# EAGLE schematic mr_radar_platypus (EAGLE 5.11)
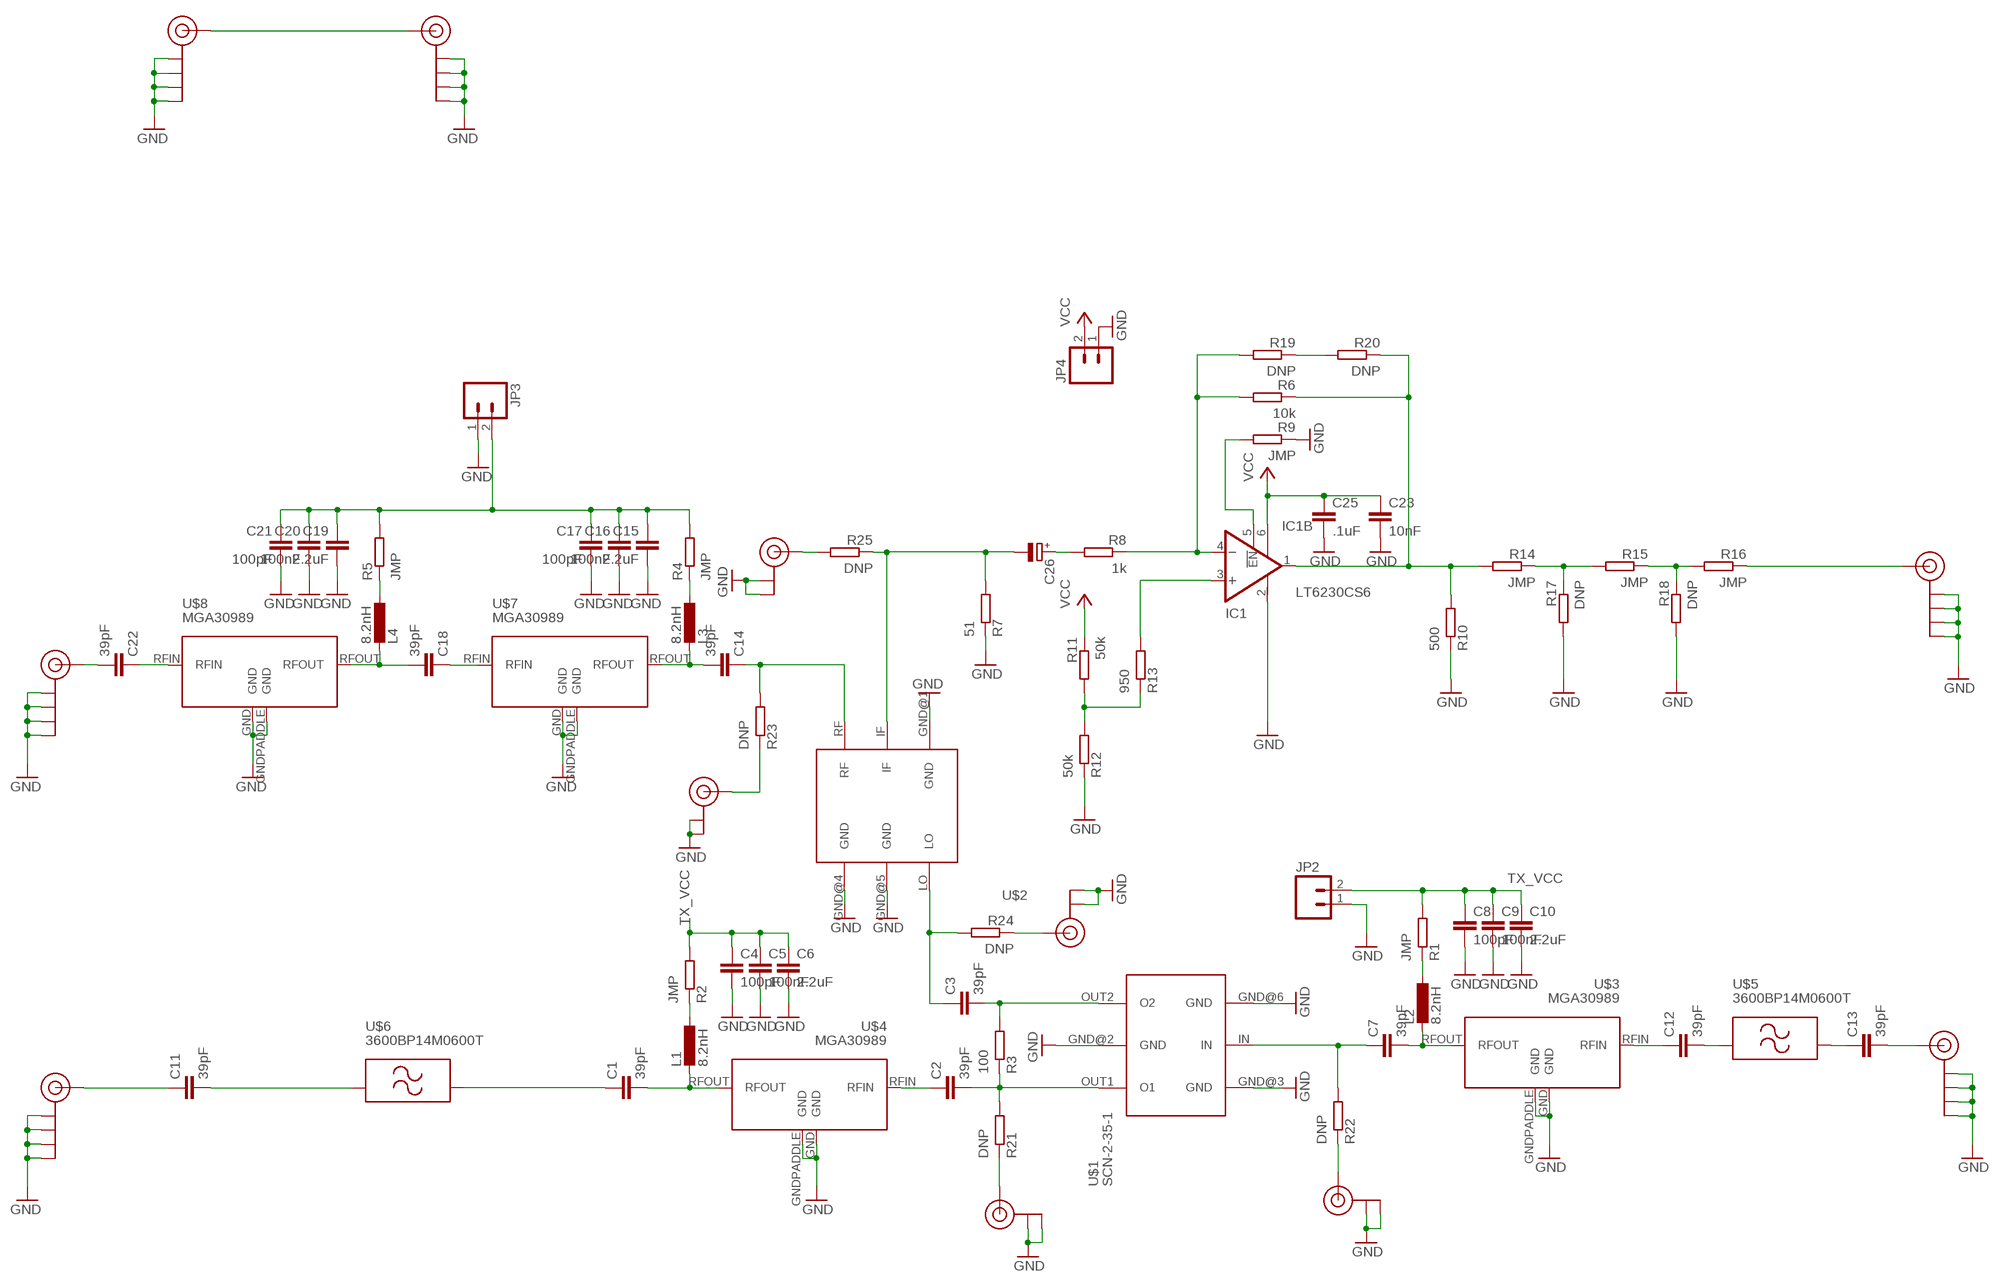
[diagram p0: schematic, sheet 1]

## Parts
C1  39pF  CAPACITOR-0402  [0402-CAP]
C2  39pF  CAPACITOR-0402  [0402-CAP]
C3  39pF  CAPACITOR-0402  [0402-CAP]
C4  100pF  CAPACITOR-0603  [0603-CAP]
C5  100nF  CAPACITOR-0603  [0603-CAP]
C6  2.2uF  CAPACITOR-0603  [0603-CAP]
C7  39pF  CAPACITOR-0402  [0402-CAP]
C8  100pF  CAPACITOR-0603  [0603-CAP]
C9  100nF  CAPACITOR-0603  [0603-CAP]
C10  2.2uF  CAPACITOR-0603  [0603-CAP]
C11  39pF  CAPACITOR-0402  [0402-CAP]
C12  39pF  CAPACITOR-0402  [0402-CAP]
C13  39pF  CAPACITOR-0402  [0402-CAP]
C14  39pF  CAPACITOR-0402  [0402-CAP]
C15  2.2uF  CAPACITOR-0402  [0402-CAP]
C16  100nF  CAPACITOR-0402  [0402-CAP]
C17  100pF  CAPACITOR-0402  [0402-CAP]
C18  39pF  CAPACITOR-0402  [0402-CAP]
C19  2.2uF  CAPACITOR-0402  [0402-CAP]
C20  100nF  CAPACITOR-0402  [0402-CAP]
C21  100pF  CAPACITOR-0402  [0402-CAP]
C22  39pF  CAPACITOR-0402  [0402-CAP]
C23  10nF  CAPACITOR-0603  [0603-CAP]
C25  .1uF  CAPACITOR-0603  [0603-CAP]
C26  CAPACITOR-POLD  [7343/D]
IC1  LT6230CS6  [TSOT23-6]
J$1  SMA_EDGE  [SMA-EDGE]
J$2  SMA_EDGE  [SMA-EDGE]
J$3  SMA_EDGE  [SMA-EDGE]
J$4  SMA_EDGE  [SMA-EDGE]
J$5  SMA_EDGE  [SMA-EDGE]
J$6  SMA_EDGE  [SMA-EDGE]
JP2  M02LOCK_LONGPADS  [1X02_LOCK_LONGPADS]
JP3  M02LOCK_LONGPADS  [1X02_LOCK_LONGPADS]
JP4  M02LOCK_LONGPADS  [1X02_LOCK_LONGPADS]
L1  8.2nH  INDUCTOR-0603  [0603-IND]
L2  8.2nH  INDUCTOR-0603  [0603-IND]
L3  8.2nH  INDUCTOR-0603  [0603-IND]
L4  8.2nH  INDUCTOR-0603  [0603-IND]
R1  JMP  RESISTOR-0603  [0603-RES]
R2  JMP  RESISTOR-0603  [0603-RES]
R3  100  RESISTOR-0603  [0603-RES]
R4  JMP  RESISTOR-0603  [0603-RES]
R5  JMP  RESISTOR-0603  [0603-RES]
R6  10k  RESISTOR-0603  [0603-RES]
R7  51  RESISTOR-0603  [0603-RES]
R8  1k  RESISTOR-0603  [0603-RES]
R9  JMP  RESISTOR-0603  [0603-RES]
R10  500  RESISTOR-0603  [0603-RES]
R11  50k  RESISTOR-0603  [0603-RES]
R12  50k  RESISTOR-0603  [0603-RES]
R13  950  RESISTOR-0603  [0603-RES]
R14  JMP  RESISTOR-0603  [0603-RES]
R15  JMP  RESISTOR-0603  [0603-RES]
R16  JMP  RESISTOR-0603  [0603-RES]
R17  DNP  RESISTOR-0603  [0603-RES]
R18  DNP  RESISTOR-0603  [0603-RES]
R19  DNP  RESISTOR-0603  [0603-RES]
R20  DNP  RESISTOR-0603  [0603-RES]
R21  DNP  RESISTOR-1206  [1206-RES]
R22  DNP  RESISTOR-1206  [1206-RES]
R23  DNP  RESISTOR-1206  [1206-RES]
R24  DNP  RESISTOR-1206  [1206-RES]
R25  DNP  RESISTOR-1206  [1206-RES]
U$1  SCN-2-35-1  [SCN-2-35-1]
U$2  ADE-30W+  [CD542]
U$3  MGA30989  [SOT89]
U$4  MGA30989  [SOT89]
U$5  3600BP14M0600T  [3600BP14M0600T]
U$6  3600BP14M0600T  [3600BP14M0600T]
U$7  MGA30989  [SOT89]
U$8  MGA30989  [SOT89]
U$9  U.FL  [U.FL]
U$10  U.FL  [U.FL]
U$11  U.FL  [U.FL]
U$12  U.FL  [U.FL]
U$13  U.FL  [U.FL]

## Nets
GND: C4.P$2 C5.P$2 C6.P$2 C8.P$2 C9.P$2 C10.P$2 C15.P$2 C16.P$2 C17.P$2 C19.P$2 C20.P$2 C21.P$2 C23.P$2 C25.P$2 IC1.2(V-) J$1.GND@0(GND) J$1.GND@1(GND) J$1.GND@2(GND) J$1.GND@3(GND) J$2.GND@0(GND) J$2.GND@1(GND) J$2.GND@2(GND) J$2.GND@3(GND) J$3.GND@0(GND) J$3.GND@1(GND) J$3.GND@2(GND) J$3.GND@3(GND) J$4.GND@0(GND) J$4.GND@1(GND) J$4.GND@2(GND) J$4.GND@3(GND) J$5.GND@0(GND) J$5.GND@1(GND) J$5.GND@2(GND) J$5.GND@3(GND) J$6.GND@0(GND) J$6.GND@1(GND) J$6.GND@2(GND) J$6.GND@3(GND) JP2.1 JP3.1 JP4.1 R7.P$1 R9.P$1 R10.P$1 R12.P$1 R17.P$2 R18.P$2 U$1.GND@2(GND) U$1.GND@3(GND) U$1.GND@6(GND) U$2.GND@1(GND) U$2.GND@4(GND) U$2.GND@5(GND) U$3.GND U$3.GNDPADDLE(GND) U$4.GND U$4.GNDPADDLE(GND) U$7.GND U$7.GNDPADDLE(GND) U$8.GND U$8.GNDPADDLE(GND) U$9.P$1(GND) U$9.P$2(GND) U$10.P$1(GND) U$10.P$2(GND) U$11.P$1(GND) U$11.P$2(GND) U$12.P$1(GND) U$12.P$2(GND) U$13.P$1(GND) U$13.P$2(GND)
N$1: C1.P$2 L1.P$2 U$4.RFOUT
N$2: C1.P$1 U$6.P$2
N$3: J$5.SIG(SIGNAL) J$6.SIG(SIGNAL)
N$4: C7.P$2 L2.P$2 U$3.RFOUT
N$5: C7.P$1 R22.P$2 U$1.IN
N$6: C2.P$1 U$4.RFIN
N$7: C2.P$2 R3.P$1 R21.P$2 U$1.OUT1(O1)
N$8: C3.P$2 R3.P$2 U$1.OUT2(O2)
N$10: C11.P$1 J$2.SIG(SIGNAL)
N$11: C11.P$2 U$6.P$1
N$12: C12.P$1 U$3.RFIN
N$13: C12.P$2 U$5.P$1
N$14: C13.P$1 U$5.P$2
N$15: C13.P$2 J$4.SIG(SIGNAL)
N$16: R25.P$2 U$13.P$3(SIGNAL)
N$17: L2.P$1 R1.P$1
N$18: L1.P$1 R2.P$1
N$19: C14.P$1 R23.P$2 U$2.RF
N$20: C14.P$2 L3.P$2 U$7.RFOUT
N$21: C18.P$2 L4.P$2 U$8.RFOUT
N$22: C26.- R7.P$2 R25.P$1 U$2.IF
N$23: C18.P$1 U$7.RFIN
N$24: R23.P$1 U$11.P$3(SIGNAL)
N$25: L3.P$1 R4.P$1
N$26: C15.P$1 C16.P$1 C17.P$1 C19.P$1 C20.P$1 C21.P$1 JP3.2 R4.P$2 R5.P$2
N$27: C22.P$1 U$8.RFIN
N$28: C22.P$2 J$1.SIG(SIGNAL)
N$29: L4.P$1 R5.P$1
N$30: IC1.4(-IN) R6.P$2 R8.P$1 R19.P$2
N$31: IC1.1(OUT) R6.P$1 R10.P$2 R14.P$2 R20.P$1
N$32: R11.P$2 R12.P$2 R13.P$1
N$33: C26.+ R8.P$2
N$34: R14.P$1 R15.P$2 R17.P$1
N$35: IC1.5(!EN) R9.P$2
N$36: R15.P$1 R16.P$2 R18.P$1
N$37: J$3.SIG(SIGNAL) R16.P$1
N$38: IC1.3(+IN) R13.P$2
N$39: R19.P$1 R20.P$2
N$40: R21.P$1 U$9.P$3(SIGNAL)
N$41: R24.P$1 U$12.P$3(SIGNAL)
N$42: R22.P$1 U$10.P$3(SIGNAL)
N$43: C3.P$1 R24.P$2 U$2.LO
TX_VCC: C4.P$1 C5.P$1 C6.P$1 C8.P$1 C9.P$1 C10.P$1 JP2.2 R1.P$2 R2.P$2
VCC: C23.P$1 C25.P$1 IC1.6(V+) JP4.2 R11.P$1

## Power pins joined to a net without a drawn wire
GND: U$5.P$GND0(GND) U$5.P$GND1(GND) U$6.P$GND0(GND) U$6.P$GND1(GND)

## Library data of the parts
C1-C23 C25 = pel_dipol_comp:CAPACITOR
C26 = pel_dipol_comp:CAPACITOR-POL
IC1 = linear-technology:LT6230: 215MHz, Rail-to-Rail Output, 1.1nV/Hz, 3.5mA Op Amp Source: http://cds.linear.com/docs/Datasheet/623012fb.pdf; MPN: LT6230CS6#TR; OC_FARNELL: 1663845; OC_NEWARK: 57M9332
J$1-J$6 = SparkFun:SMA_EDGE: SMA Antenna Connector End launch SMA connector. The paste layer has been removed so that the connector can be hand soldered onto the board after reflow.
JP2-JP4 = SparkFun:M02: Header 2 Standard 2-pin 0.1" header. Use with straight break away headers (SKU : PRT-00116), right angle break away headers (PRT-00553), swiss pins (PRT-00743), machine pins (PRT-00117), and female headers (PRT-00115). Molex polarized connector foot print use with SKU : PRT-08233 with associated crimp pins and housings.
L1-L4 = pel_dipol_comp:INDUCTOR
R1-R25 = pel_dipol_comp:RESISTOR
U$1 = mr_radar:SCN-2-35-1: Power Splitter/Combiner SCN-2-35+ mini-circuits SCN-2-35
U$2 = mr_radar:ADE-30W+
U$3 U$4 U$7 U$8 = mr_radar:MGA30989
U$5 U$6 = mr_radar:3600BP14M0600T
U$9-U$13 = SparkFun:U.FL